# EAGLE design hexa_board (EAGLE 7.2.0)
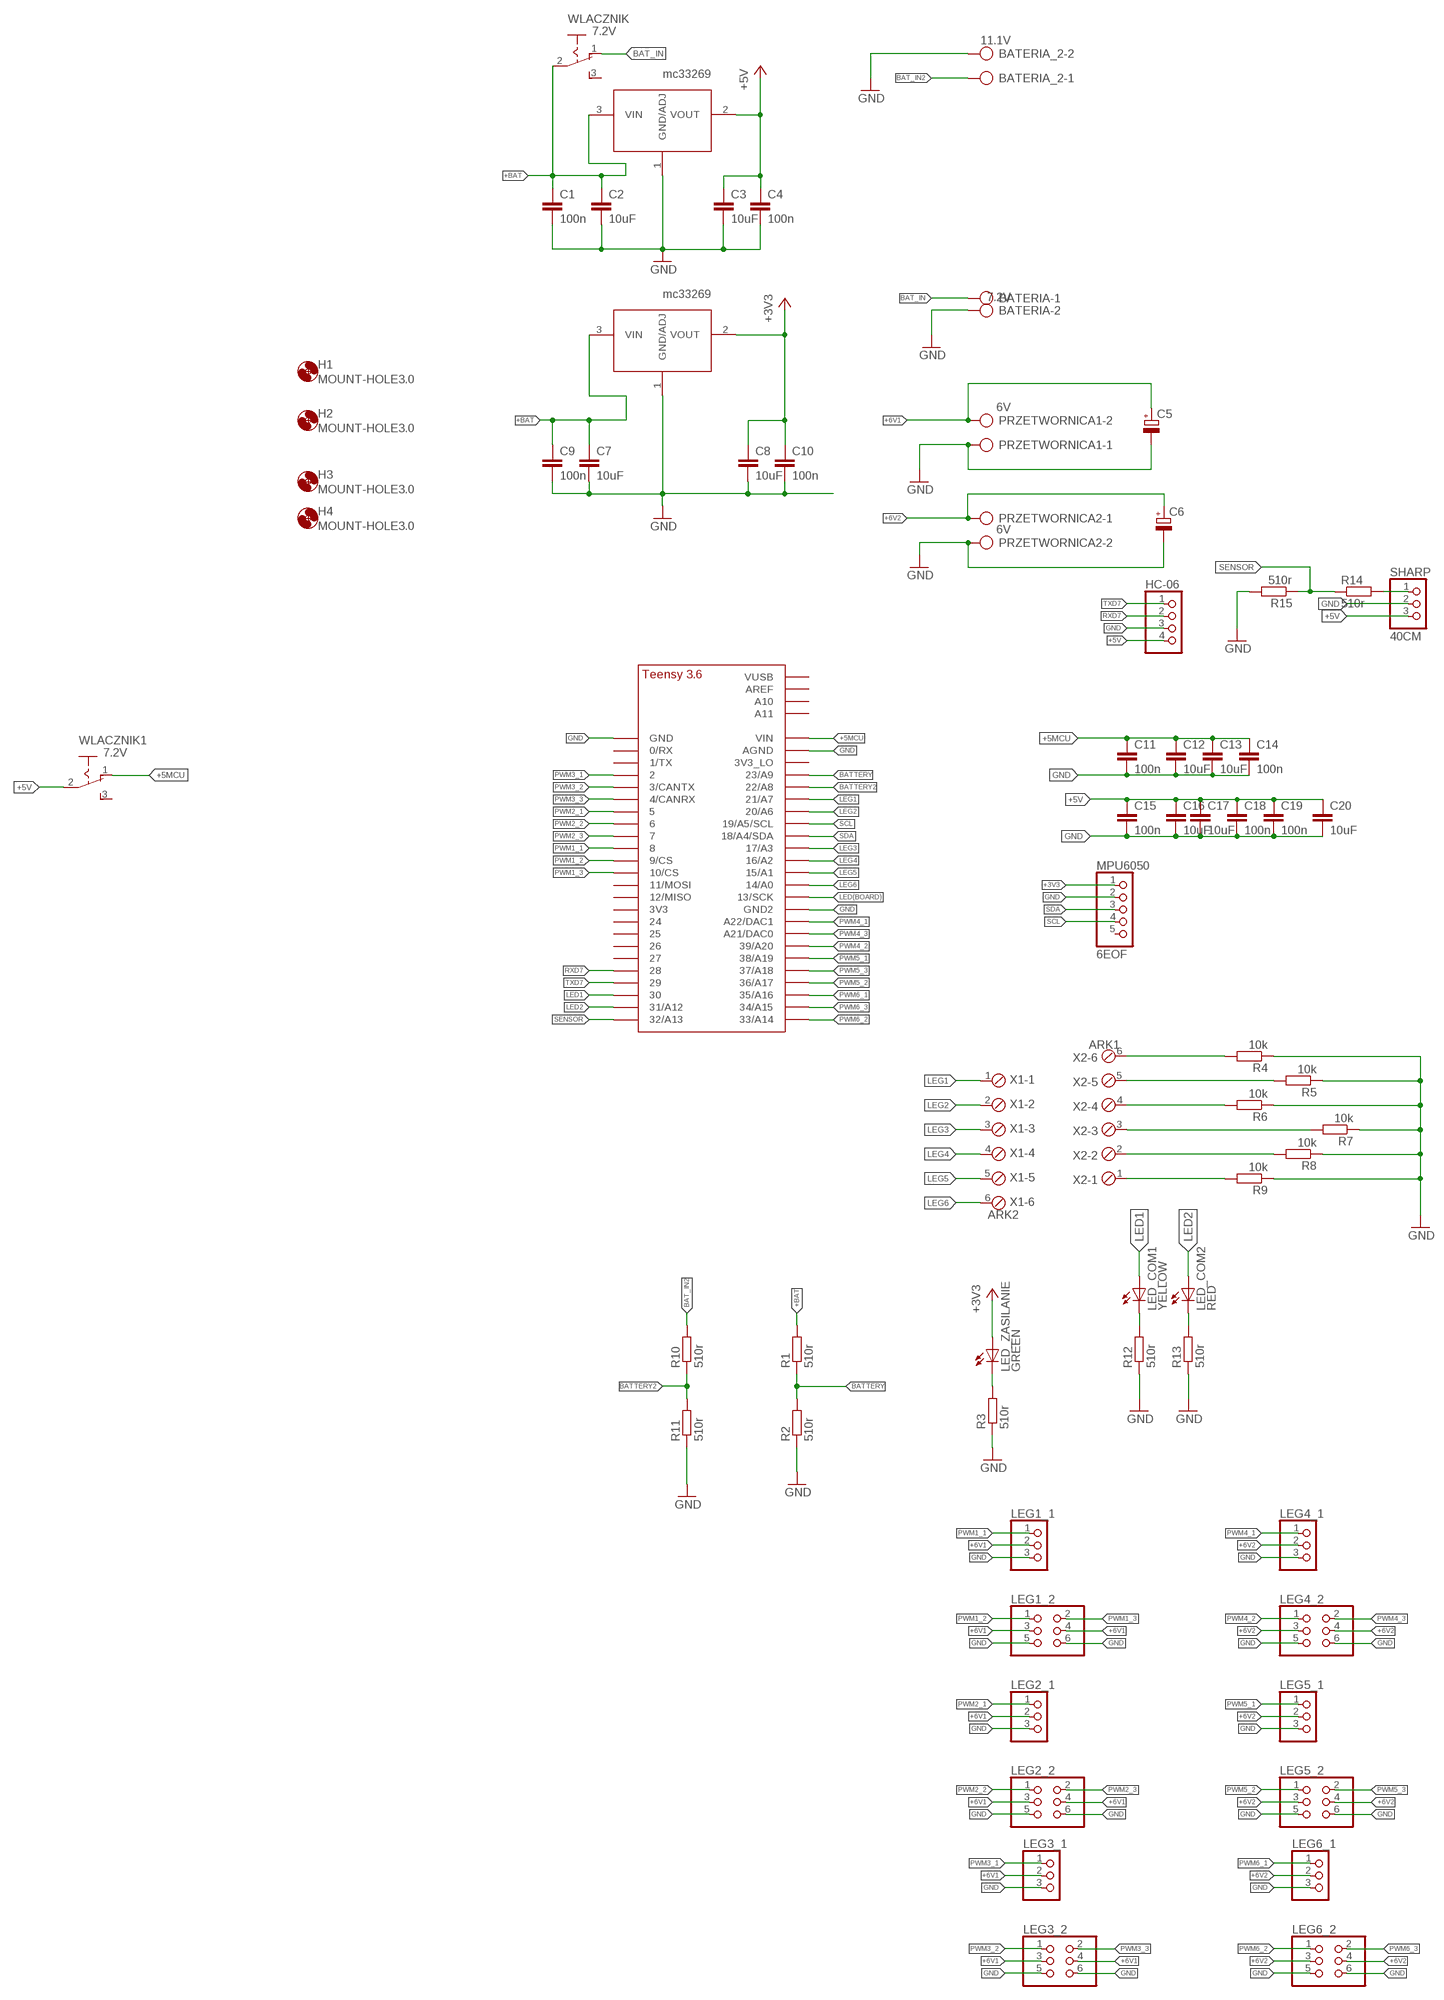
[diagram p0: schematic, sheet 1]

## Parts
3V  MC33269  [TO220]
5V  MC33269  [TO220]
BATERIA  7.2V  AK300/2  [AK300/2]
BATERIA_2  11.1V  AK300/2  [AK300/2]
C1  100n  C-EUC0805  [C0805]
C2  10uF  C-EUC1206  [C1206]
C3  10uF  C-EUC1206  [C1206]
C4  100n  C-EUC0805  [C0805]
C5  CPOL-EU150CLZ-1014  [150CLZ-1014]
C6  CPOL-EU150CLZ-1014  [150CLZ-1014]
C7  10uF  C-EUC1206  [C1206]
C8  10uF  C-EUC1206  [C1206]
C9  100n  C-EUC0805  [C0805]
C10  100n  C-EUC0805  [C0805]
C11  100n  C-EUC0805  [C0805]
C12  10uF  C-EUC1206  [C1206]
C13  10uF  C-EUC1206  [C1206]
C14  100n  C-EUC0805  [C0805]
C15  100n  C-EUC0805  [C0805]
C16  10uF  C-EUC1206  [C1206]
C17  10uF  C-EUC1206  [C1206]
C18  100n  C-EUC0805  [C0805]
C19  100n  C-EUC0805  [C0805]
C20  10uF  C-EUC1206  [C1206]
H1  MOUNT-HOLE3.0  [3,0]
H2  MOUNT-HOLE3.0  [3,0]
H3  MOUNT-HOLE3.0  [3,0]
H4  MOUNT-HOLE3.0  [3,0]
HC-06  PINHD-1X4  [1X04]
LED_COM1  YELLOW  LEDSML0805  [SML0805]
LED_COM2  RED  LEDSML0805  [SML0805]
LED_ZASILANIE  GREEN  LEDSML0805  [SML0805]
LEG1_1  PINHD-1X3  [1X03]
LEG1_2  PINHD-2X3  [2X03]
LEG2_1  PINHD-1X3  [1X03]
LEG2_2  PINHD-2X3  [2X03]
LEG3_1  PINHD-1X3  [1X03]
LEG3_2  PINHD-2X3  [2X03]
LEG4_1  PINHD-1X3  [1X03]
LEG4_2  PINHD-2X3  [2X03]
LEG5_1  PINHD-1X3  [1X03]
LEG5_2  PINHD-2X3  [2X03]
LEG6_1  PINHD-1X3  [1X03]
LEG6_2  PINHD-2X3  [2X03]
MPU6050  6EOF  PINHD-1X5  [1X05]
PRZETWORNICA1  6V  AK300/2  [AK300/2]
PRZETWORNICA2  6V  AK300/2  [AK300/2]
R1  510r  R-EU_R0805  [R0805]
R2  510r  R-EU_R0805  [R0805]
R3  510r  R-EU_R0805  [R0805]
R4  10k  R-EU_R0805  [R0805]
R5  10k  R-EU_R0805  [R0805]
R6  10k  R-EU_R0805  [R0805]
R7  10k  R-EU_R0805  [R0805]
R8  10k  R-EU_R0805  [R0805]
R9  10k  R-EU_R0805  [R0805]
R10  510r  R-EU_R0805  [R0805]
R11  510r  R-EU_R0805  [R0805]
R12  510r  R-EU_R0805  [R0805]
R13  510r  R-EU_R0805  [R0805]
R14  510r  R-EU_R0805  [R0805]
R15  510r  R-EU_R0805  [R0805]
SHARP  40CM  PINHD-1X3  [1X03]
TEENSY41  TEENSY_3.5/3.6_BASIC  [TEENSY_3.5/3.6_BASIC]
WLACZNIK  7.2V  255SB  [255SB]
WLACZNIK1  7.2V  255SB  [255SB]
X1  ARK2  MPT6  [6POL254]
X2  ARK1  MPT6  [6POL254]

## Nets
+3V3: 3V.2(VOUT) C8.1 C10.1 LED_ZASILANIE.A MPU6050.1
+5MCU: C11.1 C12.1 C13.1 C14.1 TEENSY41.VIN WLACZNIK1.1(O)
+5V: 5V.2(VOUT) C3.1 C4.1 C15.1 C16.1 C17.1 C18.1 C19.1 C20.1 HC-06.4 SHARP.3 WLACZNIK1.2(P)
+6V1: C5.+ LEG1_1.2 LEG1_2.3 LEG1_2.4 LEG2_1.2 LEG2_2.3 LEG2_2.4 LEG3_1.2 LEG3_2.3 LEG3_2.4 PRZETWORNICA1.2
+6V2: C6.+ LEG4_1.2 LEG4_2.3 LEG4_2.4 LEG5_1.2 LEG5_2.3 LEG5_2.4 LEG6_1.2 LEG6_2.3 LEG6_2.4 PRZETWORNICA2.1
+BAT: 3V.3(VIN) 5V.3(VIN) C1.1 C2.1 C7.1 C9.1 R1.2 WLACZNIK.2(P)
BAT_IN: BATERIA.1 WLACZNIK.1(O)
BAT_IN2: BATERIA_2.1 R10.2
BATTERY: R1.1 R2.2 TEENSY41.23/A9
BATTERY2: R10.1 R11.2 TEENSY41.22/A8
GND: 3V.1(GND/ADJ) 5V.1(GND/ADJ) BATERIA.2 BATERIA_2.2 C1.2 C2.2 C3.2 C4.2 C5.- C6.- C7.2 C8.2 C9.2 C10.2 C11.2 C12.2 C13.2 C14.2 C15.2 C16.2 C17.2 C18.2 C19.2 C20.2 HC-06.3 LEG1_1.3 LEG1_2.5 LEG1_2.6 LEG2_1.3 LEG2_2.5 LEG2_2.6 LEG3_1.3 LEG3_2.5 LEG3_2.6 LEG4_1.3 LEG4_2.5 LEG4_2.6 LEG5_1.3 LEG5_2.5 LEG5_2.6 LEG6_1.3 LEG6_2.5 LEG6_2.6 MPU6050.2 PRZETWORNICA1.1 PRZETWORNICA2.2 R2.1 R3.1 R4.1 R5.1 R6.1 R7.1 R8.1 R9.1 R11.1 R12.1 R13.1 R15.2 SHARP.2 TEENSY41.AGND TEENSY41.GND TEENSY41.GND2
LED1: LED_COM1.A TEENSY41.30
LED2: LED_COM2.A TEENSY41.31/A12
LED(BOARD): TEENSY41.13/SCK
LEG1: TEENSY41.21/A7 X1.1
LEG2: TEENSY41.20/A6 X1.2
LEG3: TEENSY41.17/A3 X1.3
LEG4: TEENSY41.16/A2 X1.4
LEG5: TEENSY41.15/A1 X1.5
LEG6: TEENSY41.14/A0 X1.6
N$1: R4.2 X2.6
N$2: R5.2 X2.5
N$3: R6.2 X2.4
N$4: LED_ZASILANIE.C R3.2
N$5: R7.2 X2.3
N$6: R8.2 X2.2
N$7: R9.2 X2.1
N$8: LED_COM1.C R12.2
N$9: LED_COM2.C R13.2
N$10: R14.2 SHARP.1
PWM1_1: LEG1_1.1 TEENSY41.8
PWM1_2: LEG1_2.1 TEENSY41.9/CS
PWM1_3: LEG1_2.2 TEENSY41.10/CS
PWM2_1: LEG2_1.1 TEENSY41.5
PWM2_2: LEG2_2.1 TEENSY41.6
PWM2_3: LEG2_2.2 TEENSY41.7
PWM3_1: LEG3_1.1 TEENSY41.2
PWM3_2: LEG3_2.1 TEENSY41.3/CANTX
PWM3_3: LEG3_2.2 TEENSY41.4/CANRX
PWM4_1: LEG4_1.1 TEENSY41.A22/DAC1
PWM4_2: LEG4_2.1 TEENSY41.39/A20
PWM4_3: LEG4_2.2 TEENSY41.21/DAC0(A21/DAC0)
PWM5_1: LEG5_1.1 TEENSY41.38/A19
PWM5_2: LEG5_2.1 TEENSY41.36/A17
PWM5_3: LEG5_2.2 TEENSY41.37/A18
PWM6_1: LEG6_1.1 TEENSY41.35/A16
PWM6_2: LEG6_2.1 TEENSY41.33/A14
PWM6_3: LEG6_2.2 TEENSY41.34/A15
RXD7: HC-06.2 TEENSY41.28
SCL: MPU6050.4 TEENSY41.19/A5/SCL
SDA: MPU6050.3 TEENSY41.18/A4/SDA
SENSOR: R14.1 R15.1 TEENSY41.32/A13
TXD7: HC-06.1 TEENSY41.29
Unconnected: MPU6050.5 TEENSY41.0/RX TEENSY41.1/TX TEENSY41.3V3 TEENSY41.3V3_LO TEENSY41.11/MOSI TEENSY41.12/MISO TEENSY41.24 TEENSY41.25 TEENSY41.26 TEENSY41.27 TEENSY41.A10 TEENSY41.A11 TEENSY41.AREF TEENSY41.VUSB WLACZNIK1.3(S) WLACZNIK.3(S)

## Library data of the parts
3V 5V = mc33269:MC33269: MC33269 voltage regulator, by ON semiconductor, in TO220 package
BATERIA BATERIA_2 PRZETWORNICA1 PRZETWORNICA2 = con-ptr500:AK300/2: CONNECTOR; OC_FARNELL: unknown; OC_NEWARK: unknown
C1-C4 C7-C20 = rcl:C-EU: CAPACITOR, European symbol
C5 C6 = rcl:CPOL-EU: POLARIZED CAPACITOR, European symbol
H1-H4 = holes:MOUNT-HOLE: MOUNTING HOLE with drill center marker
HC-06 = pinhead:PINHD-1X4: PIN HEADER
LED_COM1 LED_COM2 LED_ZASILANIE = led:LED: LED OSRAM: - CHIPLED LG R971, LG N971, LY N971, LG Q971, LY Q971, LO R971, LY R971 LH N974, LH R974 LS Q976, LO Q976, LY Q976 LO Q996 - Hyper CHIPLED LW Q18S LB Q993, LB Q99A, LB R99A - SideLED LS A670, LO A670, LY A670, LG A670, LP A670 LB A673, LV A673, LT A673, LW A673 LH A674 LY A675 LS A676, LA A676, LO A676, LY A676, LW A676 LS A679, LY A679, LG A679 - Hyper Micro SIDELED® LS Y876, LA Y876, LO Y876, LY Y876 LT Y87S - SmartLED LW L88C, LW L88S LB L89C, LB L89S, LG L890 LS L89K, LO L89K, LY L89K LS L896, LA L896, LO L896, LY L896 - TOPLED LS T670, LO T670, LY T670, LG T670, LP T670 LSG T670, LSP T670, LSY T670, LOP T670, LYG T670 LG T671, LOG T671, LSG T671 LB T673, LV T673, LT T673, LW T673 LH T674 LS T676, LA T676, LO T676, LY T676, LB T676, LH T676, LSB T676, LW T676 LB T67C, LV T67C, LT T67C, LS T67K, LO T67K, LY T67K, LW E67C LS E67B, LA E67B, LO E67B, LY E67B, LB E67C, LV E67C, LT E67C LW T67C LS T679, LY T679, LG T679 LS T770, LO T770, LY T770, LG T770, LP T770 LB T773, LV T773, LT T773, LW T773 LH T774 LS E675, LA E675, LY E675, LS T675 LS T776, LA T776, LO T776, LY T776, LB T776 LHGB T686 LT T68C, LB T68C - Hyper Mini TOPLED® LB M676 - Mini TOPLED Santana® LG M470 LS M47K, LO M47K, LY M47K Source: http://www.osram.convergy.de LUXEON: - LUMILED® LXK2-PW12-R00, LXK2-PW12-S00, LXK2-PW14-U00, LXK2-PW14-V00 LXK2-PM12-R00, LXK2-PM12-S00, LXK2-PM14-U00 LXK2-PE12-Q00, LXK2-PE12-R00, LXK2-PE12-S00, LXK2-PE14-T00, LXK2-PE14-U00 LXK2-PB12-K00, LXK2-PB12-L00, LXK2-PB12-M00, LXK2-PB14-N00, LXK2-PB14-P00, LXK2-PB14-Q00 LXK2-PR12-L00, LXK2-PR12-M00, LXK2-PR14-Q00, LXK2-PR14-R00 LXK2-PD12-Q00, LXK2-PD12-R00, LXK2-PD12-S00 LXK2-PH12-R00, LXK2-PH12-S00 LXK2-PL12-P00, LXK2-PL12-Q00, LXK2-PL12-R00 Source: www.luxeon.com KINGBRIGHT: KA-3528ASYC Source: www.kingbright.com
LEG1_1 LEG2_1 LEG3_1 LEG4_1 LEG5_1 LEG6_1 SHARP = pinhead:PINHD-1X3: PIN HEADER
LEG1_2 LEG2_2 LEG3_2 LEG4_2 LEG5_2 LEG6_2 = pinhead:PINHD-2X3: PIN HEADER
MPU6050 = pinhead:PINHD-1X5: PIN HEADER
R1-R15 = rcl:R-EU_: RESISTOR, European symbol
TEENSY41 = teensy:TEENSY_3.5/3.6_BASIC
WLACZNIK WLACZNIK1 = switch:255SB: SLIDING SWITCH Distributor Buerklin, 11G810
X1 X2 = con-phoenix-254:MPT6: PHOENIX CONNECTOR; OC_FARNELL: unknown; OC_NEWARK: unknown

## Board
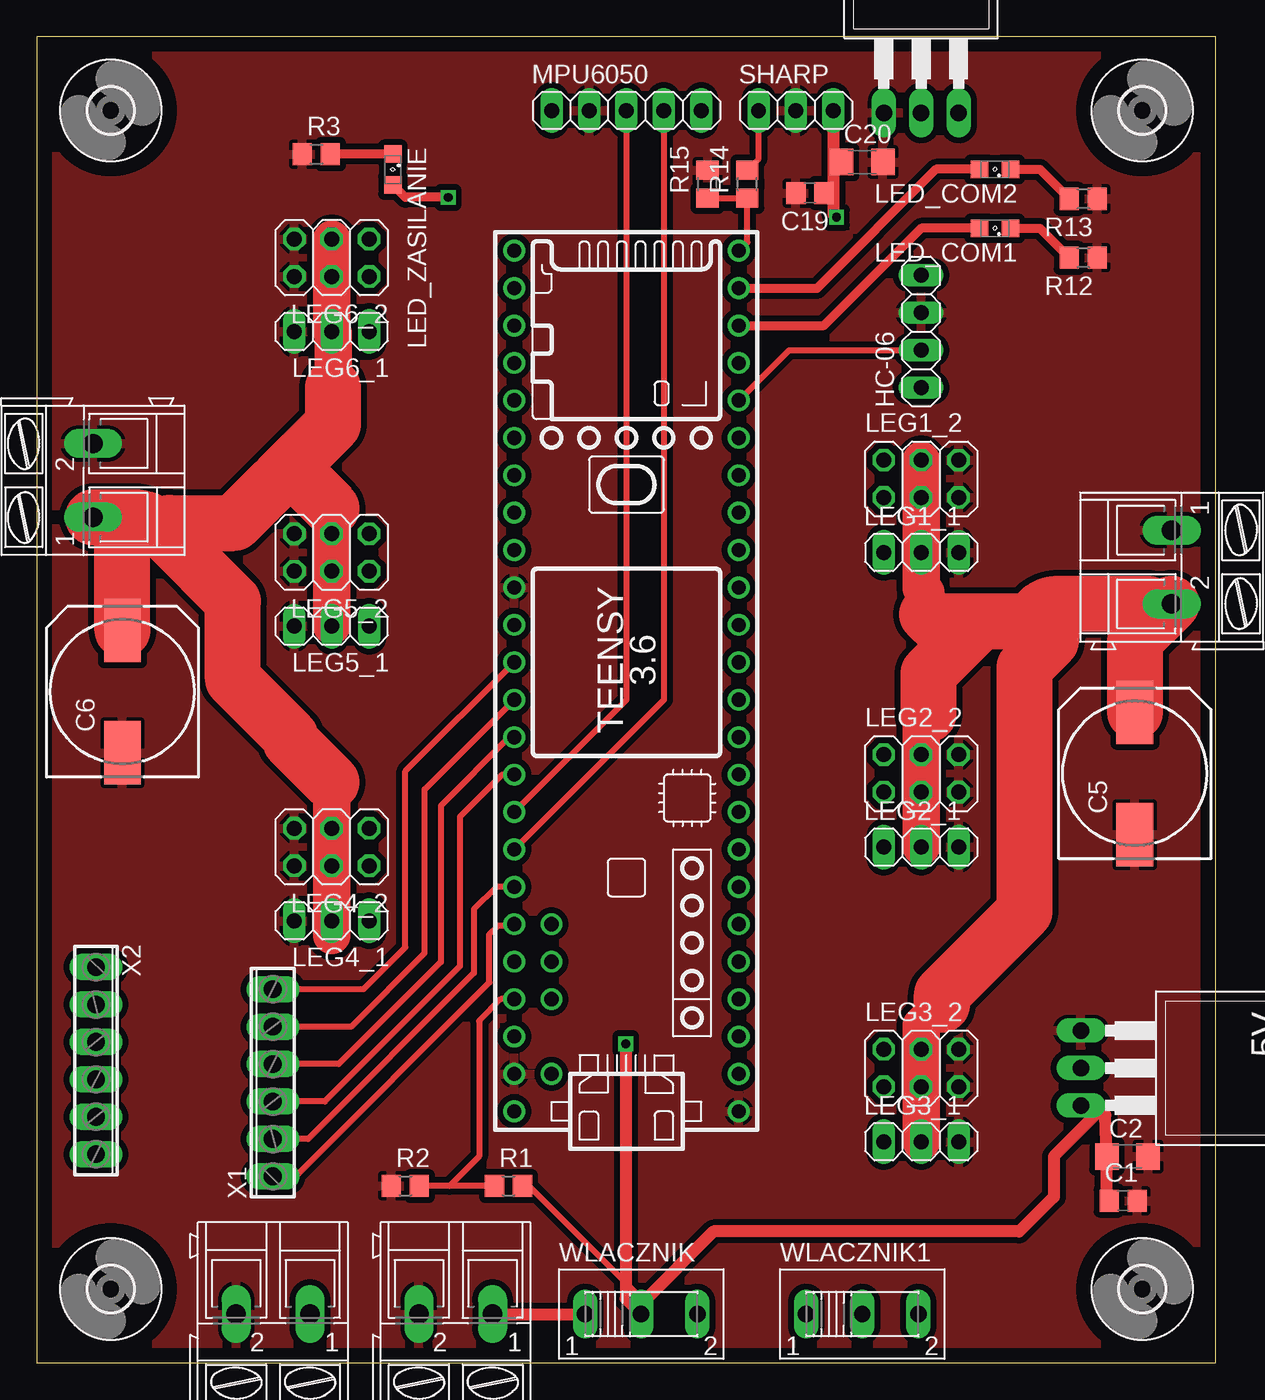
[diagram p1: board, top side]
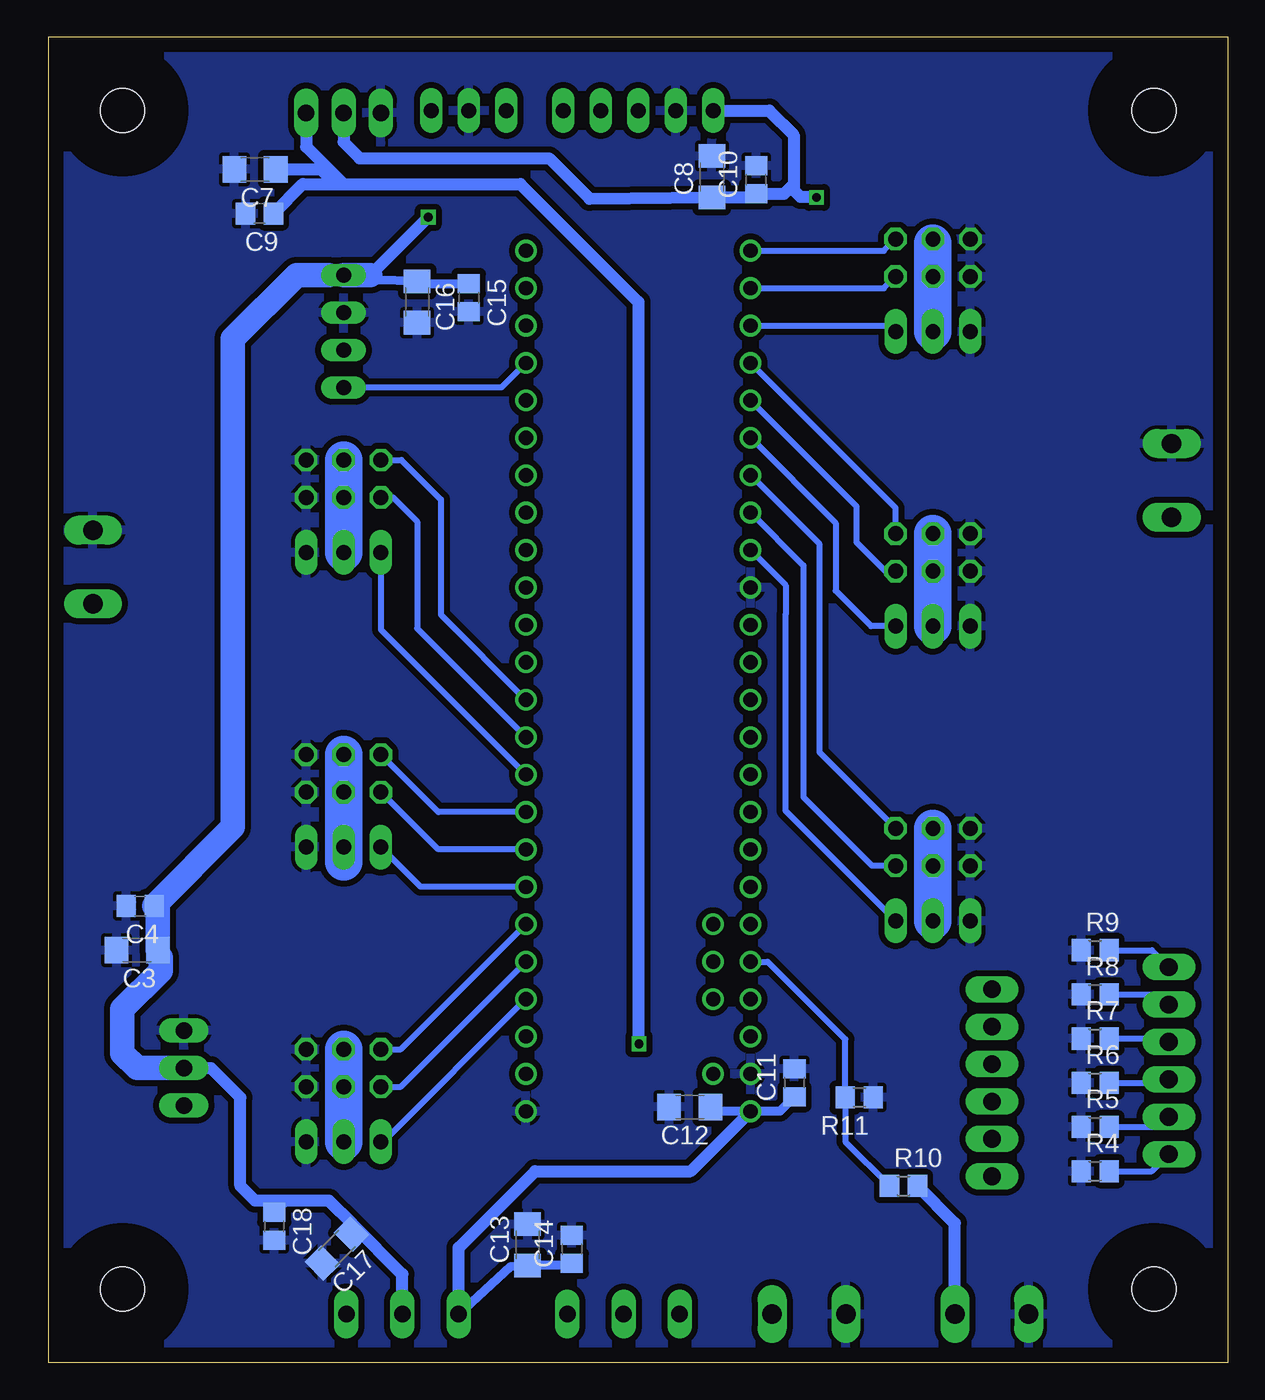
[diagram p2: board, bottom side, seen from below]

Size 80 x 90 mm. Coordinates in mm from the lower left corner, seen from the top.
Outline: 0,0 80,0 80,90 0,90 0,0
Copper layers (1*16): Top 0.035mm / dielectric 1.5mm / Bottom 0.035mm
Design rules "default *": minimum track width 10mil, minimum drill 0.00761875mm, track to track 8mil, track to pad 8mil, pad to pad 8mil, via to via 8mil, smd to smd 8mil, copper to edge 40mil, drill to drill 8mil, minimum pad ring 10mil, minimum via ring 8mil, stop-mask expansion 4mil, vias tented up to drill 0mil, thermal gap 10mil

### Footprints (pad centres in the part's own frame; a part is rotated, then mirrored left to right if it is on the bottom)
TO220 = drill 1.118 long: 1 -2.54,-10.16; 2 0,-10.16; 3 2.54,-10.16
AK300/2 = drill 1.321 long: 1 -2.515,0; 2 2.489,0
C0805 = smd 1.3 x 1.5: 1 -0.95,0; 2 0.95,0
C1206 = smd 1.6 x 1.8: 1 -1.4,0; 2 1.4,0
150CLZ-1014 = smd 4.3 x 2.5: + 4.15,0; - -4.15,0
3,0 = hole 3: 0,0
1X04 = drill 1.016 long: 1 -3.81,0; 2 -1.27,0; 3 1.27,0; 4 3.81,0
SML0805 = smd 1.2 x 1.2: A 1.05,0; C -1.05,0
1X03 = drill 1.016 long: 1 -2.54,0; 2 0,0; 3 2.54,0
2X03 = drill 1.016 octagon: 1 -2.54,-1.27; 2 -2.54,1.27; 3 0,-1.27; 4 0,1.27; 5 2.54,-1.27; 6 2.54,1.27
1X05 = drill 1.016 long: 1 -5.08,0; 2 -2.54,0; 3 0,0; 4 2.54,0; 5 5.08,0
R0805 = smd 1.3 x 1.5: 1 -0.95,0; 2 0.95,0
TEENSY_3.5/3.6_BASIC = drill 0.965: 0/RX -25.4,-7.62; 1/TX -22.86,-7.62; 2 -20.32,-7.62; 3/CANTX -17.78,-7.62; 3V3 7.62,-7.62; 3V3_LO -22.86,7.62; 4/CANRX -15.24,-7.62; 5 -12.7,-7.62; 6 -10.16,-7.62; 7 -7.62,-7.62; 8 -5.08,-7.62; 9/CS -2.54,-7.62; 10/CS 0,-7.62; 11/MOSI 2.54,-7.62; 12/MISO 5.08,-7.62; 13/SCK 5.08,7.62; 14/A0 2.54,7.62; 15/A1 0,7.62; 16/A2 -2.54,7.62; 17/A3 -5.08,7.62; 18/A4/SDA -7.62,7.62; 19/A5/SCL -10.16,7.62; 20/A6 -12.7,7.62; 21/A7 -15.24,7.62; 21/DAC0 12.7,7.62; 22/A8 -17.78,7.62; 23/A9 -20.32,7.62; 24 10.16,-7.62; 25 12.7,-7.62; 26 15.24,-7.62; 27 17.78,-7.62; 28 20.32,-7.62; 29 22.86,-7.62; 30 25.4,-7.62; 31/A12 27.94,-7.62; 32/A13 30.48,-7.62; 33/A14 30.48,7.62; 34/A15 27.94,7.62; 35/A16 25.4,7.62; 36/A17 22.86,7.62; 37/A18 20.32,7.62; 38/A19 17.78,7.62; 39/A20 15.24,7.62; A10 -17.78,5.08; A11 -15.24,5.08; A22/DAC1 10.16,7.62; AGND -25.4,7.62; AREF -20.32,5.08; GND -27.94,-7.62; GND2 7.62,7.62; VIN -27.94,7.62; VUSB -25.4,5.08
255SB = drill 1.118 long: 1 -3.81,0; 2 0,0; 3 3.81,0
6POL254 = drill 1.2 pad 1.778 long: 1 -6.35,0; 2 -3.81,0; 3 -1.27,0; 4 1.27,0; 5 3.81,0; 6 6.35,0

### Placement (x,y rotation side)
3V  60,95 0 top
5V  81,20 270 top
BATERIA  28.4,3.3 180 top
BATERIA_2  16,3.3 180 top
C1  73.7,11 0 top
C2  74,14 0 top
C3  74,28 180 bottom
C4  73.8,31 180 bottom
C5  74.5,40 90 top
C6  5.8,45.55 90 top
C7  66,81 180 bottom
C8  35,80.5 90 bottom
C9  65.7,78 180 bottom
C10  32,80.3 90 bottom
C11  29.4,19 90 bottom
C12  36.5,17.35 180 bottom
C13  47.5,8 90 bottom
C14  44.5,7.7 90 bottom
C15  51.5,72.3 270 bottom
C16  55,72 270 bottom
C17  60.45,7.75 225 bottom
C18  64.7,9.25 270 bottom
C19  52.45,79.4 180 top
C20  56,81.5 0 top
H1  75,85 0 top
H2  5,85 0 top
H3  75,5 0 top
H4  5,5 0 top
HC-06  60,70 90 top
LED_COM1  65,77 180 top
LED_COM2  65,81 180 top
LED_ZASILANIE  24.15,80.99 270 top
LEG1_1  60,55 0 top
LEG1_2  60,60 0 top
LEG2_1  60,35 0 top
LEG2_2  60,40 0 top
LEG3_1  60,15 0 top
LEG3_2  60,20 0 top
LEG4_1  20,30 180 top
LEG4_2  20,35 180 top
LEG5_1  20,50 180 top
LEG5_2  20,55 180 top
LEG6_1  20,70 180 top
LEG6_2  20,75 180 top
MPU6050  40,85 0 top
PRZETWORNICA1  77,54 270 top
PRZETWORNICA2  3.8,59.9 90 top
R1  32,12 0 top
R2  25,12 0 top
R3  18.96,82.03 0 top
R4  9,13 0 bottom
R5  9,16 0 bottom
R6  9,19 0 bottom
R7  9,22 0 bottom
R8  9,25 0 bottom
R9  9,28 0 bottom
R10  22,12 0 bottom
R11  25,18 180 bottom
R12  71,75 180 top
R13  71,79 180 top
R14  48.2,80 90 top
R15  45.5,80 90 top
SHARP  51.5,85 0 top
TEENSY41  40,45 90 top
WLACZNIK  41,3.3 0 top
WLACZNIK1  56,3.3 0 top
X1  16,19 90 top
X2  4,20.5 270 top

### Tracks (layer width: path | path; a pad name or v marks a point on that pad's centre or on a via)
+3V3  (via drill 0.6)
  Top 0.61: v27.9,79.1 24.99,79.1 LED_ZASILANIE.A
  Bottom 0.813: v27.9,79.1 27.94,79.14 29,79.14 29.45,79.59 29.45,80 | MPU6050.1 31.1,85 29.45,83.35 29.45,80 | 3V.2 60,82.85 58.9,81.75 46.05,81.75 43.3,79 C8.1 32.25,79.1 C10.1 30.1,79.35 29.45,80
+5MCU
  Bottom 0.61: C12.1 34.71,17.06 TEENSY41.VIN 30.39,17.06 C11.1 | WLACZNIK1.1 48.69,6.5 C13.1 44.65,6.6 C14.1
  Bottom 0.813: WLACZNIK1.1 52.19,7.81 47,13 36.44,13 TEENSY41.VIN
+5V  (via drill 0.6)
  Top 0.406: C20.1 54.04,81.5 54.04,81 | 54.04,79.3 53.95,79.3 C19.1
  Top 0.813: SHARP.3 54.04,81 54.04,79.3 54.04,77.96 v54.25,77.75
  Bottom 0.61: 58.19,73.81 57.88,73.5 C16.1 54.85,73.25 C15.1
  Bottom 0.813: v54.25,77.75 58.19,73.81 | WLACZNIK1.2 56,6 59.39,9.39 | 59.39,9.39 61,11 64,11 | 64,11 66,11 67,12 67,18 69,20 5V.2 | C17.1 59.39,9.39 | C18.1 64.25,10.75 64,11
  Bottom 1.016: HC-06.4 61,73.81
  Bottom 1.676: 61,73.81 63.19,73.81 67.5,69.5 67.5,36.35 C4.1 72.6,30.75 C3.1 72.5,27.6 72.4,27.5 72.4,26.6 75,24 75,21 74,20 5V.2 | 58.19,73.81 HC-06.4
+6V1
  Top 0.406: LEG2_2.3 60,38 | 64,50.3 63,50.3 63,51 61,51 61,50 62,50 62,47 61,47 61,42 60,41 60,45 65,50 64,50
  Top 2.54: LEG1_2.4 LEG1_2.3 LEG1_1.2 60,52.6 60.3,52.3 60.3,50.7 | LEG2_1.2 LEG2_2.3 60,41 LEG2_2.4 60,43.5 60.5,44 | LEG3_1.2 LEG3_2.3 LEG3_2.4 60,22.9 61.4,24.3 | 67.72,50.28 67.7,50.3 | 60.4,50.8 60.4,50.6 | 60.4,50.6 61,50 | 60.3,50.7 60,51 | 60.3,50.7 60.4,50.6 | 69.18,50.18 69,50 | 68.8,49.8 64.2,49.8 64,50 | PRZETWORNICA1.2 75.43,51.51 arc45 75.4,51.5
  Top 3.81: 67.7,50.3 64,50.3 | 64,50.3 60.9,50.3 60.4,50.8 | 60.5,44 60.5,46.8 64,50.3 | 61.4,24.3 61.4,25 67,30.6 67,47.2 68.8,49 | 68.8,49 68.8,49.8 69,50 | 75.4,51.5 69.21,51.5 arc45 68,51 68,50.85 arc45 68.74,49.06 68.8,49 | PRZETWORNICA1.2 74.5,49.01 C5.+
  Bottom 2.54: LEG1_2.4 LEG1_1.2 | LEG2_2.4 60,34 | LEG3_2.4 LEG3_1.2
+6V2
  Top 2.54: LEG6_2.3 LEG6_2.4 LEG6_1.2 20.1,69.9 20.1,66.2 | LEG5_1.2 LEG5_2.4 LEG5_2.3 20,58 | 20,29 LEG4_2.4 LEG4_2.3 20,39.4 | 9,56 9,57 | 18,60 16.4,60 16.2,59.8
  Top 3.81: 9,57 13.4,57 16.2,59.8 | 16.4,60 20.1,63.7 20.1,66.2 | 20,58 18,60 | 20,39.4 17.2,42.2 17.2,42.5 13.3,46.4 13.3,51.7 9,56 8.36,56.64 arc45 6.56,57.38 5,57.38 | PRZETWORNICA2.1 5,57.38 | C6.+ 5.8,56.59 5,57.38
  Bottom 2.54: LEG6_1.2 20,76 | LEG5_2.3 LEG5_1.2 | LEG4_2.3 LEG4_1.2
+BAT  (via drill 0.6)
  Top 0.406: 41,4.38 33.38,12 R1.2
  Top 0.813: 41,4 WLACZNIK.2 39.95,4.35 v39.95,21.65 | 41,4 41,4.38 | 41,4 45.9,8.9 66.65,8.9 69,11.25 69,14 71.84,16.84 5V.3 72.5,16.8 C2.1 72.6,11.15 C1.1
  Bottom 0.813: 60.54,80 60,80 | 60,80 48,80 40,72 40,21.7 v39.95,21.65 | C7.1 61.54,81 60.54,80 | 3V.3 62.54,82.54 60,80 | C9.1 62.75,80 60.54,80
BAT_IN
  Top 0.813: BATERIA.1 WLACZNIK.1
BAT_IN2
  Bottom 0.813: BATERIA_2.1 18.52,9.47 R10.2
BATTERY
  Top 0.406: R1.1 28,12 | 28,12 R2.2 | 28,12 30,14 30,23.2 31.48,24.68 TEENSY41.23/A9
BATTERY2
  Bottom 0.406: TEENSY41.22/A8 31.22,27.22 25.95,21.95 R11.2 25.95,15 R10.1
GND
  pour Top (isolate 0.406): -57,-45 146,-45 146,132 -57,132
  pour Bottom (isolate 0.406): -52,-52 151,-52 151,125 -52,125
LED1
  Top 0.61: TEENSY41.30 53.4,70.4 60,77 LED_COM1.A
LED2
  Top 0.61: TEENSY41.31/A12 52.94,72.94 61,81 LED_COM2.A
LEG1
  Top 0.406: TEENSY41.21/A7 32.27,29.65 31.25,29.65 30.7,29.1 30.7,25.8 17.55,12.65 X1.1
LEG2
  Top 0.406: TEENSY41.20/A6 31.15,32.3 29.65,30.8 29.65,26.45 18.39,15.19 X1.2
LEG3
  Top 0.406: X1.3 19.53,17.73 28.7,26.9 28.7,37.05 31.57,39.92 TEENSY41.17/A3
LEG4
  Top 0.406: TEENSY41.16/A2 32.06,42.46 27.4,37.8 27.4,27.2 20.47,20.27 X1.4
LEG5
  Top 0.406: TEENSY41.15/A1 26.3,38.92 26.3,27.8 21.31,22.81 X1.5
LEG6
  Top 0.406: TEENSY41.14/A0 25,40.16 25,28.2 22.15,25.35 X1.6
N$1
  Bottom 0.406: R4.2 5.15,13 X2.6
N$2
  Bottom 0.406: R5.2 4.69,16 X2.5
N$3
  Bottom 0.406: R6.2 4.23,19 X2.4
N$4
  Top 0.406: R3.2
  Top 0.61: LED_ZASILANIE.C R3.2
N$5
  Bottom 0.406: R7.2 4.23,22 X2.3
N$6
  Bottom 0.406: R8.2 4.69,25 X2.2
N$7
  Bottom 0.406: R9.2 5.15,28 X2.1
N$8
  Top 0.61: LED_COM1.C 68.05,77 R12.2
N$9
  Top 0.61: LED_COM2.C 68.05,81 R13.2
N$10
  Top 0.406: R14.2 48.96,81.71 SHARP.1
PWM1_1
  Bottom 0.406: LEG1_1.1 57.46,49.76 TEENSY41.8
PWM1_2
  Bottom 0.406: LEG1_2.1 56.63,58.73 55,57.1 55,49.84 TEENSY41.9/CS
PWM1_3
  Bottom 0.406: LEG1_2.2 56.07,61.27 53.4,58.6 53.4,50.78 TEENSY41.10/CS
PWM2_1
  Bottom 0.406: TEENSY41.5 54.76,32.3 LEG2_1.1
PWM2_2
  Bottom 0.406: TEENSY41.6 53.57,34.84 LEG2_2.1
PWM2_3
  Bottom 0.406: TEENSY41.7 53.57,37.38 LEG2_2.2
PWM3_1
  Bottom 0.406: LEG3_1.1 57.3,15 TEENSY41.2
PWM3_2
  Bottom 0.406: LEG3_2.1 56.11,18.73 TEENSY41.3/CANTX
PWM3_3
  Bottom 0.406: LEG3_2.2 56.11,21.27 TEENSY41.4/CANRX
PWM4_1
  Bottom 0.406: LEG4_1.1 30,37.46 30,50 30,50.8 30,52.78 TEENSY41.A22/DAC1
PWM4_2
  Bottom 0.406: LEG4_2.1 27.7,41.43 27.7,55.56 TEENSY41.39/A20
PWM4_3
  Bottom 0.406: TEENSY41.21/DAC0 28.8,54.12 28.8,38.4 24.13,33.73 LEG4_2.2
PWM5_1
  Bottom 0.406: TEENSY41.38/A19 26.6,57 26.6,52.4 24.2,50 LEG5_1.1
PWM5_2
  Bottom 0.406: LEG5_2.1 22.54,58.02 TEENSY41.36/A17
PWM5_3
  Bottom 0.406: TEENSY41.37/A18 25.2,58.14 25.2,55.7 23.23,53.73 LEG5_2.2
PWM6_1
  Bottom 0.406: TEENSY41.35/A16 22.94,70.4 LEG6_1.1
PWM6_2
  Bottom 0.406: TEENSY41.33/A14 23.33,75.48 LEG6_2.1
PWM6_3
  Bottom 0.406: TEENSY41.34/A15 23.33,72.94 LEG6_2.2
RXD7
  Top 0.406: TEENSY41.28 51.03,68.73 HC-06.2
SCL
  Top 0.406: MPU6050.4 42.54,45 TEENSY41.19/A5/SCL
SDA
  Top 0.406: MPU6050.3 40,45 TEENSY41.18/A4/SDA
SENSOR
  Top 0.406: TEENSY41.32/A13 48.2,76.06 R14.1 R15.1
TXD7
  Bottom 0.406: TEENSY41.29 49.29,66.19 HC-06.1